# EAGLE design ChimesV1 (EAGLE 9.3.1)
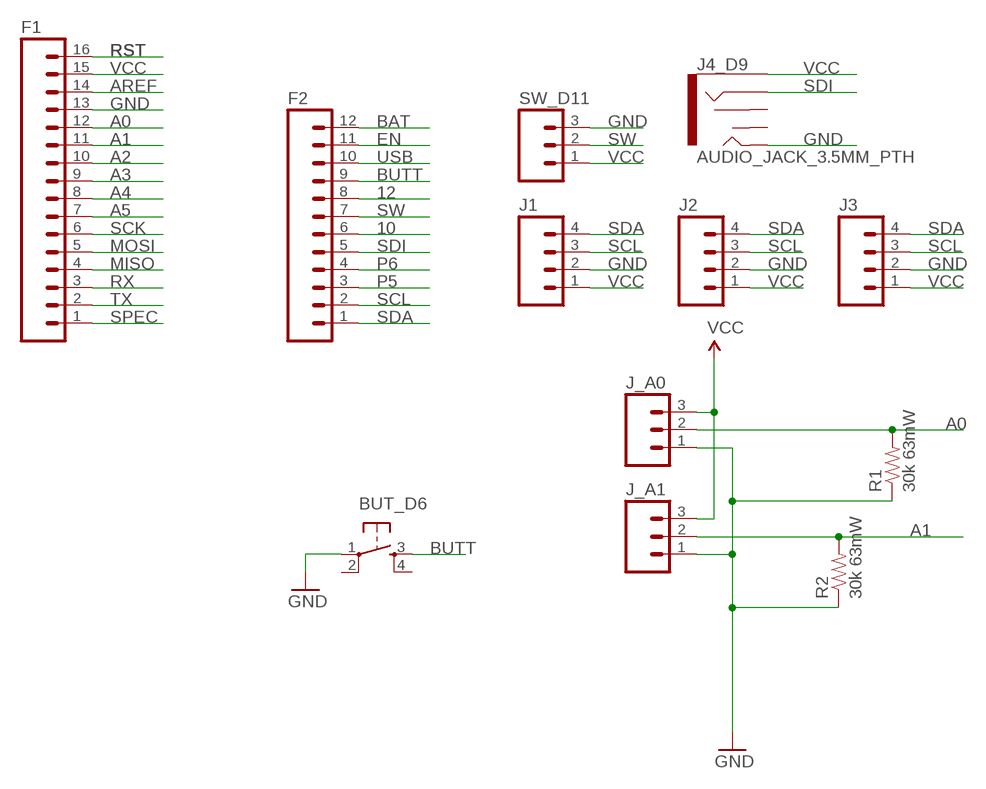
[diagram p0: schematic, sheet 1]

## Parts
BUT_D6  TAC_SWITCHPTH  [TACTILE-PTH]
F1  M16PTH  [1X16]
F2  M12PTH  [1X12]
J1  M04PTH  [1X04]
J2  M04PTH  [1X04]
J3  M04PTH  [1X04]
J4_D9  AUDIO_JACK_3.5MM_PTH  [AUDIO-JACK]
J_A0  M03JST-PTH-VERT  [JST-3-PTH-VERT]
J_A1  M03JST-PTH-VERT  [JST-3-PTH-VERT]
R1  30k 63mW  RESISTOR1206  [1206]
R2  30k 63mW  RESISTOR1206  [1206]
SW_D11  M03PTH  [1X03]

## Nets
10: F2.6
12: F2.8
A0: F1.12 J_A0.2 R1.2
A1: F1.11 J_A1.2 R2.2
A2: F1.10
A3: F1.9
A4: F1.8
A5: F1.7
AREF: F1.14
BAT: F2.12
BUTT: BUT_D6.3 F2.9
EN: F2.11
GND: BUT_D6.1 F1.13 J1.2 J2.2 J3.2 J4_D9.TIP J_A0.1 J_A1.1 R1.1 R2.1 SW_D11.3
MISO: F1.4
MOSI: F1.5
P5: F2.3
P6: F2.4
RST: F1.16
RX: F1.3
SCK: F1.6
SCL: F2.2 J1.3 J2.3 J3.3
SDA: F2.1 J1.4 J2.4 J3.4
SDI: F2.5 J4_D9.RING
SPEC: F1.1
SW: F2.7 SW_D11.2
TX: F1.2
USB: F2.10
VCC: F1.15 J1.1 J2.1 J3.1 J4_D9.SLEEVE J_A0.3 J_A1.3 SW_D11.1
Unconnected: BUT_D6.2 BUT_D6.4 J4_D9.RSH J4_D9.TSH

## Library data of the parts
BUT_D6 = SparkFun-Retired:TAC_SWITCH: Momentary Switch Button commonly used for reset or general input. Spark Fun Electronics SKU : COM-00097 SMT- SWCH-08247
F1 = SparkFun-Connectors:M16: 1x16 .1" header
F2 = SparkFun-Connectors:M12: Header 12 Standard 12-pin 0.1" header. Use with straight break away headers (SKU : PRT-00116), right angle break away headers (PRT-00553), swiss pins (PRT-00743), machine pins (PRT-00117), and female headers (PRT-00115).
J1-J3 = SparkFun-Connectors:M04: Header 4 Standard 4-pin 0.1" header. Use with straight break away headers (SKU : PRT-00116), right angle break away headers (PRT-00553), swiss pins (PRT-00743), machine pins (PRT-00117), and female headers (PRT-00115). Molex polarized connector foot print use with SKU : PRT-08231 with associated crimp pins and housings. 1MM SMD Version SKU: PRT-10208; PROD_ID: CONN-09696
J4_D9 = SparkFun-Connectors:AUDIO_JACK_3.5MM: Audio Jack 3.5mm variants of PTH and SMT stereo audio jack with bypass switches. SparkFun Products: SparkFun SparkPunk Sound Kit <[https://www.sparkfun.com/products/11177]> - PTH MP3 Trigger <https://www.sparkfun.com/products/13720> -3.5mm SMD SparkFun PicoBoard <https://www.sparkfun.com/products/11888>- 2.5mm SMD; PROD_ID: CONN-08774; SF_ID: PRT-08032
J_A0 J_A1 SW_D11 = SparkFun-Connectors:M03: Header 3 Standard 3-pin 0.1" header. Use with straight break away headers (SKU : PRT-00116), right angle break away headers (PRT-00553), swiss pins (PRT-00743), machine pins (PRT-00117), and female headers (PRT-00115). Molex polarized connector foot print use with SKU : PRT-08232 with associated crimp pins and housings.
R1 R2 = SparkFun-Resistors:RESISTOR: Resistor Basic schematic elements and footprints for 0603, 1206, and PTH resistors.

## Board
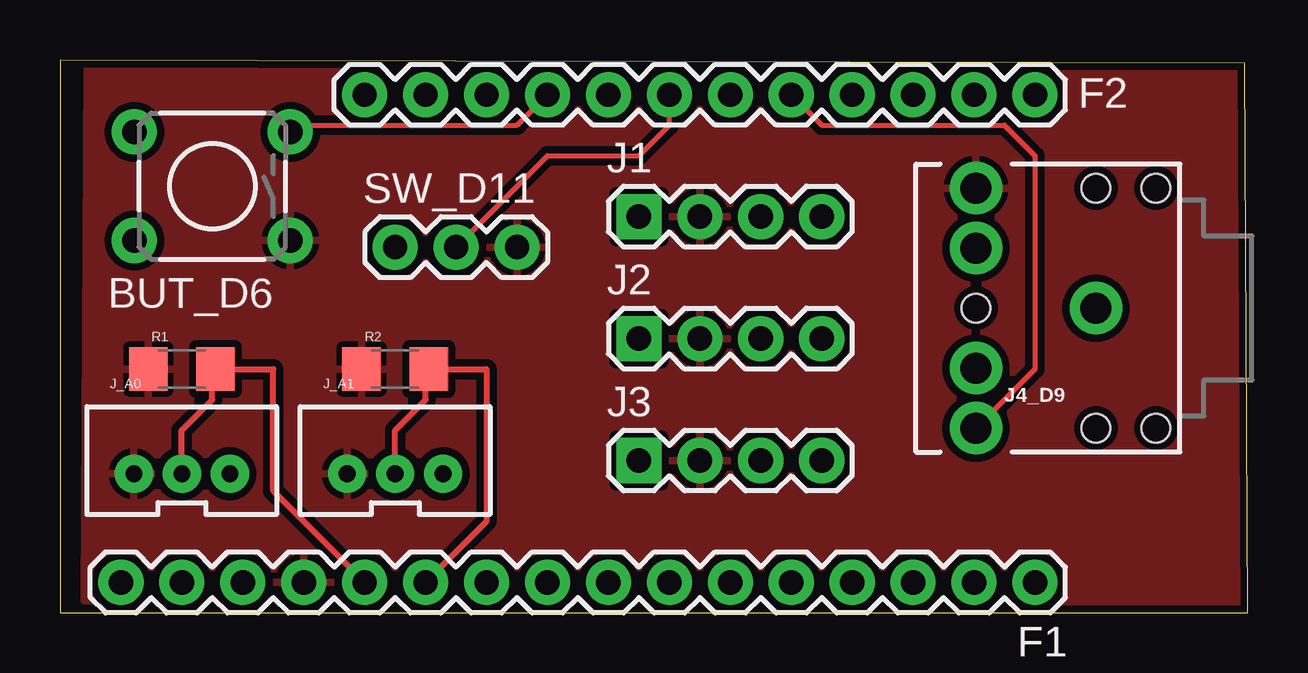
[diagram p1: board, top side]
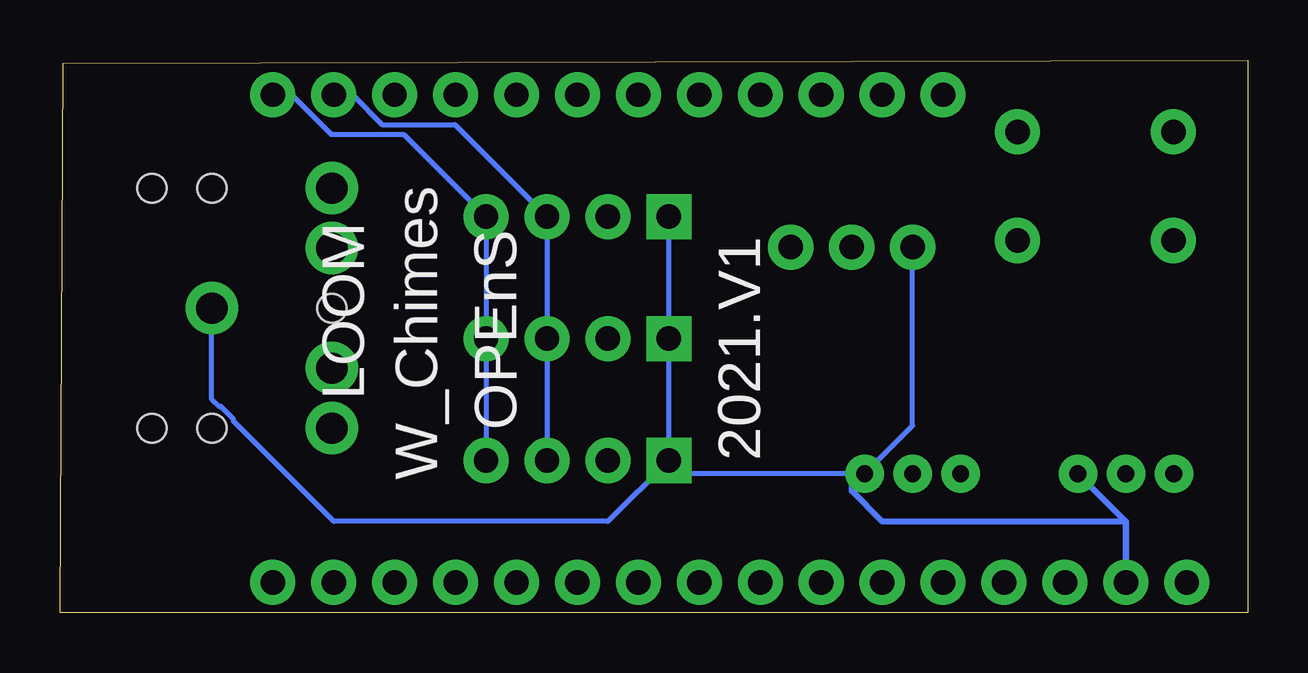
[diagram p2: board, bottom side, seen from below]

Size 49.51 x 23.04 mm. Coordinates in mm from the lower left corner, seen from the top.
Outline: 0,0 49.51,0 49.38,22.91 0,23.04 0,0
Copper layers (1*16): Top 0.035mm / dielectric 1.5mm / Bottom 0.035mm
Design rules "SparkFun": minimum track width 8mil, minimum drill 20mil, track to track 8mil, track to pad 8mil, pad to pad 8mil, via to via 8mil, smd to smd 8mil, copper to edge 8mil, drill to drill 8mil, minimum pad ring 12mil, minimum via ring 10mil, stop-mask expansion 4mil, vias tented up to drill 20mil, thermal gap 10mil

### Footprints (pad centres in the part's own frame; a part is rotated, then mirrored left to right if it is on the bottom)
TACTILE-PTH = drill 1.016 pad 1.88: 1 -3.251,2.261; 2 3.251,2.261; 3 -3.251,-2.261; 4 3.251,-2.261
1X16 = drill 1.016 pad 1.88: 1 0,0; 2 2.54,0; 3 5.08,0; 4 7.62,0; 5 10.16,0; 6 12.7,0; 7 15.24,0; 8 17.78,0; 9 20.32,0; 10 22.86,0; 11 25.4,0; 12 27.94,0; 13 30.48,0; 14 33.02,0; 15 35.56,0; 16 38.1,0
1X12 = drill 1.016 pad 1.88: 1 0,0; 2 2.54,0; 3 5.08,0; 4 7.62,0; 5 10.16,0; 6 12.7,0; 7 15.24,0; 8 17.78,0; 9 20.32,0; 10 22.86,0; 11 25.4,0; 12 27.94,0
1X04 = drill 1.016 pad 1.88 square: 1 0,0 | drill 1.016 pad 1.88: 2 2.54,0; 3 5.08,0; 4 7.62,0
AUDIO-JACK = drill 1.3 pad 2.184: RING 5,5; RSH 5,2.5; SLEEVE 0,0; TIP 5,-5; TSH 5,-2.5 | hole 1.2: 0,5; -2.5,5; -2.5,-5; 0,-5; 5,0
JST-3-PTH-VERT = drill 0.7 pad 1.6: 1 -2,-0.55; 2 0,-0.55; 3 2,-0.55
1206 = smd 1.6 x 1.8: 1 -1.4,0; 2 1.4,0
1X03 = drill 1.016 pad 1.88: 1 0,0; 2 2.54,0; 3 5.08,0

### Placement (x,y rotation side)
BUT_D6  6.35,17.78 180 top
F1  40.64,1.27 180 top
F2  40.64,21.59 180 top
J1  24.13,16.51 0 top
J2  24.13,11.43 0 top
J3  24.13,6.35 0 top
J4_D9  43.18,12.7 180 top
J_A0  5.08,6.35 0 top
J_A1  13.97,6.35 0 top
R1  5.08,10.16 0 top
R2  13.97,10.16 0 top
SW_D11  13.97,15.24 0 top

### Tracks (layer width: path | path; a pad name or v marks a point on that pad's centre or on a via)
A0
  Top 0.254: F1.12 8.89,5.08 8.89,10.16 R1.2 6.35,10.03 6.35,8.89 5.08,7.62 J_A0.2
A1
  Top 0.254: J_A1.2 13.97,7.62 15.24,8.89 15.24,10.03 R2.2 17.78,10.16 17.78,3.81 F1.11
BUTT
  Top 0.203: BUT_D6.3 9.88,20.32 19.05,20.32 F2.9
GND
  pour Top (isolate 0.305): 1.14,22.86 1.02,0.51 49.53,0 49.53,22.86
SCL
  Bottom 0.203: F2.2 37.32,21.59 36.08,20.34 33.05,20.34 J1.3 J2.3 J3.3
SDA
  Bottom 0.203: F2.1 39.86,21.59 38.21,19.94 35.18,19.94 J1.4 J2.4 J3.4
SDI
  Top 0.203: F2.5 31.75,20.32 39.37,20.32 40.64,19.05 40.64,10.16 J4_D9.RING
SW
  Top 0.203: SW_D11.2 20.32,19.05 24.13,19.05 25.4,20.32 F2.7
VCC
  Bottom 0.203: J3.1 23.58,5.8 J_A1.3 13.97,7.8 SW_D11.1 | J3.1 J2.1 J1.1 | J3.1 26.67,3.81 38.1,3.81 42.27,7.99 42.27,8.07 42.8,8.61 42.9,8.61 43.18,8.89 J4_D9.SLEEVE
  Bottom 0.254: J_A0.3 5.08,3.8 F1.15 5.08,3.81 15.24,3.81 16.51,5.08 16.51,5.26 J_A1.3

### Text on the board
bPlace: W_Chimes | LOOM | OPEnS | 2021.V1